# EAGLE design KIK01_LED_Brd (EAGLE 7.2.0)
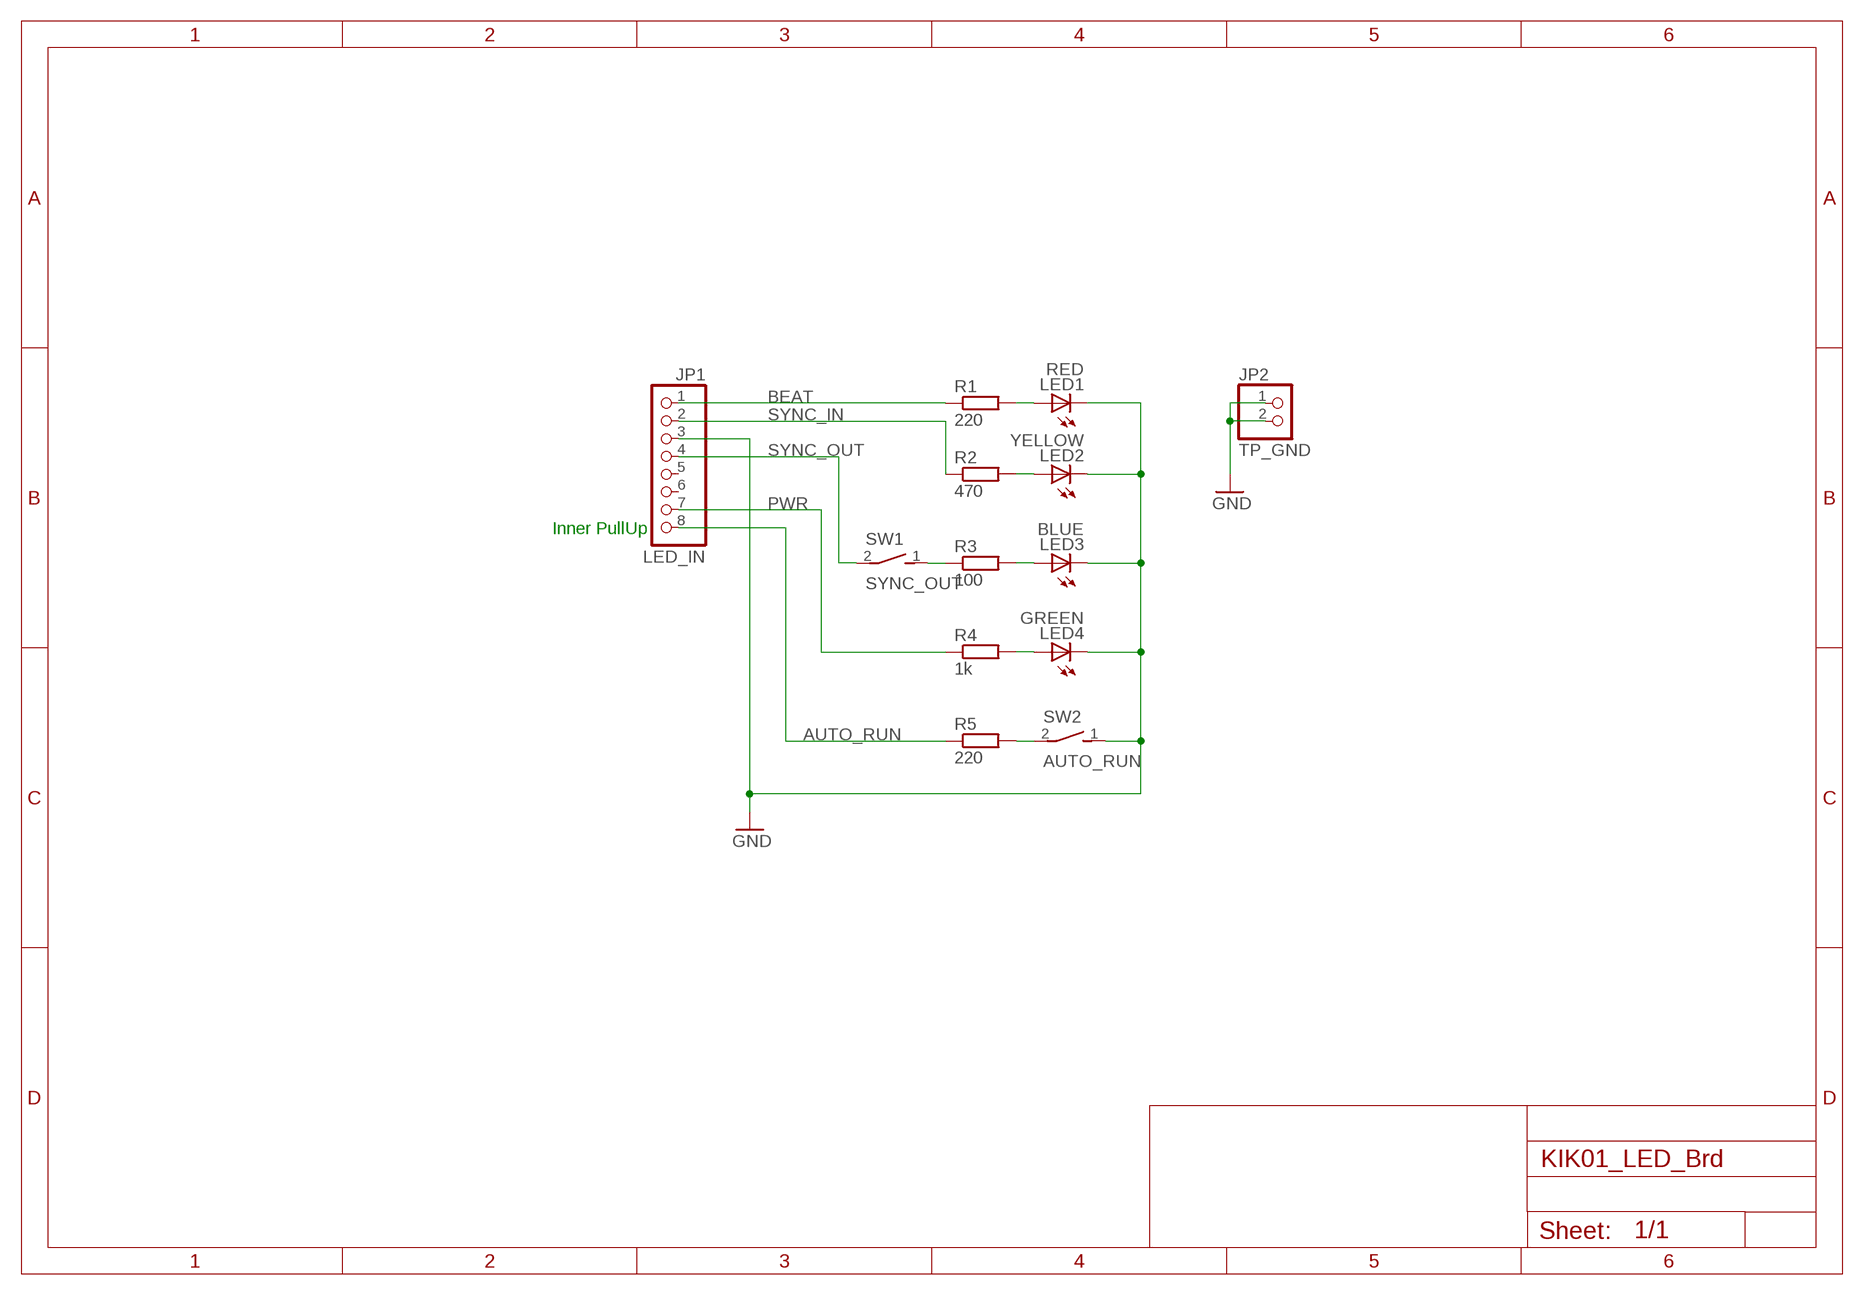
[diagram p0: schematic, sheet 1]

## Parts
JP1  LED_IN  PINHD-1X8  [1X08]
JP2  TP_GND  PINHD-1X2  [1X02]
LED1  RED  LED3MM  [LED3MM]
LED2  YELLOW  LED3MM  [LED3MM]
LED3  BLUE  LED3MM  [LED3MM]
LED4  GREEN  LED3MM  [LED3MM]
R1  220  R-EU_0204/7  [0204/7]
R2  470  R-EU_0204/7  [0204/7]
R3  100  R-EU_0204/7  [0204/7]
R4  1k  R-EU_0204/7  [0204/7]
R5  220  R-EU_0204/7  [0204/7]
SW1  SYNC_OUT  TOGGLE_SW_SPST  [TOGGLE_SW_SPST]
SW2  AUTO_RUN  TOGGLE_SW_SPST  [TOGGLE_SW_SPST]

## Nets
AUTO_RUN: JP1.8 R5.1
BEAT: JP1.1 R1.1
GND: JP1.3 JP2.1 JP2.2 LED1.K(C) LED2.K(C) LED3.K(C) LED4.K(C) SW2.1(S)
N$1: R3.1 SW1.1(S)
N$7: LED1.A R1.2
N$8: LED2.A R2.2
N$9: LED3.A R3.2
N$10: LED4.A R4.2
N$12: R5.2 SW2.2(P)
PWR: JP1.7 R4.1
SYNC_IN: JP1.2 R2.1
SYNC_OUT: JP1.4 SW1.2(P)
Unconnected: JP1.5 JP1.6

## Notes on the sheet
- Inner PullUp

## Library data of the parts
JP1 = pinhead:PINHD-1X8: PIN HEADER
JP2 = pinhead:PINHD-1X2: PIN HEADER
LED1-LED4 = led:LED: LED OSRAM: - CHIPLED LG R971, LG N971, LY N971, LG Q971, LY Q971, LO R971, LY R971 LH N974, LH R974 LS Q976, LO Q976, LY Q976 LO Q996 - Hyper CHIPLED LW Q18S LB Q993, LB Q99A, LB R99A - SideLED LS A670, LO A670, LY A670, LG A670, LP A670 LB A673, LV A673, LT A673, LW A673 LH A674 LY A675 LS A676, LA A676, LO A676, LY A676, LW A676 LS A679, LY A679, LG A679 - Hyper Micro SIDELED® LS Y876, LA Y876, LO Y876, LY Y876 LT Y87S - SmartLED LW L88C, LW L88S LB L89C, LB L89S, LG L890 LS L89K, LO L89K, LY L89K LS L896, LA L896, LO L896, LY L896 - TOPLED LS T670, LO T670, LY T670, LG T670, LP T670 LSG T670, LSP T670, LSY T670, LOP T670, LYG T670 LG T671, LOG T671, LSG T671 LB T673, LV T673, LT T673, LW T673 LH T674 LS T676, LA T676, LO T676, LY T676, LB T676, LH T676, LSB T676, LW T676 LB T67C, LV T67C, LT T67C, LS T67K, LO T67K, LY T67K, LW E67C LS E67B, LA E67B, LO E67B, LY E67B, LB E67C, LV E67C, LT E67C LW T67C LS T679, LY T679, LG T679 LS T770, LO T770, LY T770, LG T770, LP T770 LB T773, LV T773, LT T773, LW T773 LH T774 LS E675, LA E675, LY E675, LS T675 LS T776, LA T776, LO T776, LY T776, LB T776 LHGB T686 LT T68C, LB T68C - Hyper Mini TOPLED® LB M676 - Mini TOPLED Santana® LG M470 LS M47K, LO M47K, LY M47K Source: http://www.osram.convergy.de LUXEON: - LUMILED® LXK2-PW12-R00, LXK2-PW12-S00, LXK2-PW14-U00, LXK2-PW14-V00 LXK2-PM12-R00, LXK2-PM12-S00, LXK2-PM14-U00 LXK2-PE12-Q00, LXK2-PE12-R00, LXK2-PE12-S00, LXK2-PE14-T00, LXK2-PE14-U00 LXK2-PB12-K00, LXK2-PB12-L00, LXK2-PB12-M00, LXK2-PB14-N00, LXK2-PB14-P00, LXK2-PB14-Q00 LXK2-PR12-L00, LXK2-PR12-M00, LXK2-PR14-Q00, LXK2-PR14-R00 LXK2-PD12-Q00, LXK2-PD12-R00, LXK2-PD12-S00 LXK2-PH12-R00, LXK2-PH12-S00 LXK2-PL12-P00, LXK2-PL12-Q00, LXK2-PL12-R00 Source: www.luxeon.com KINGBRIGHT: KA-3528ASYC Source: www.kingbright.com
R1-R5 = rcl:R-EU_: RESISTOR, European symbol
SW1 SW2 = mylib2:TOGGLE_SW_SPST: Toggle switch SPST

## Board
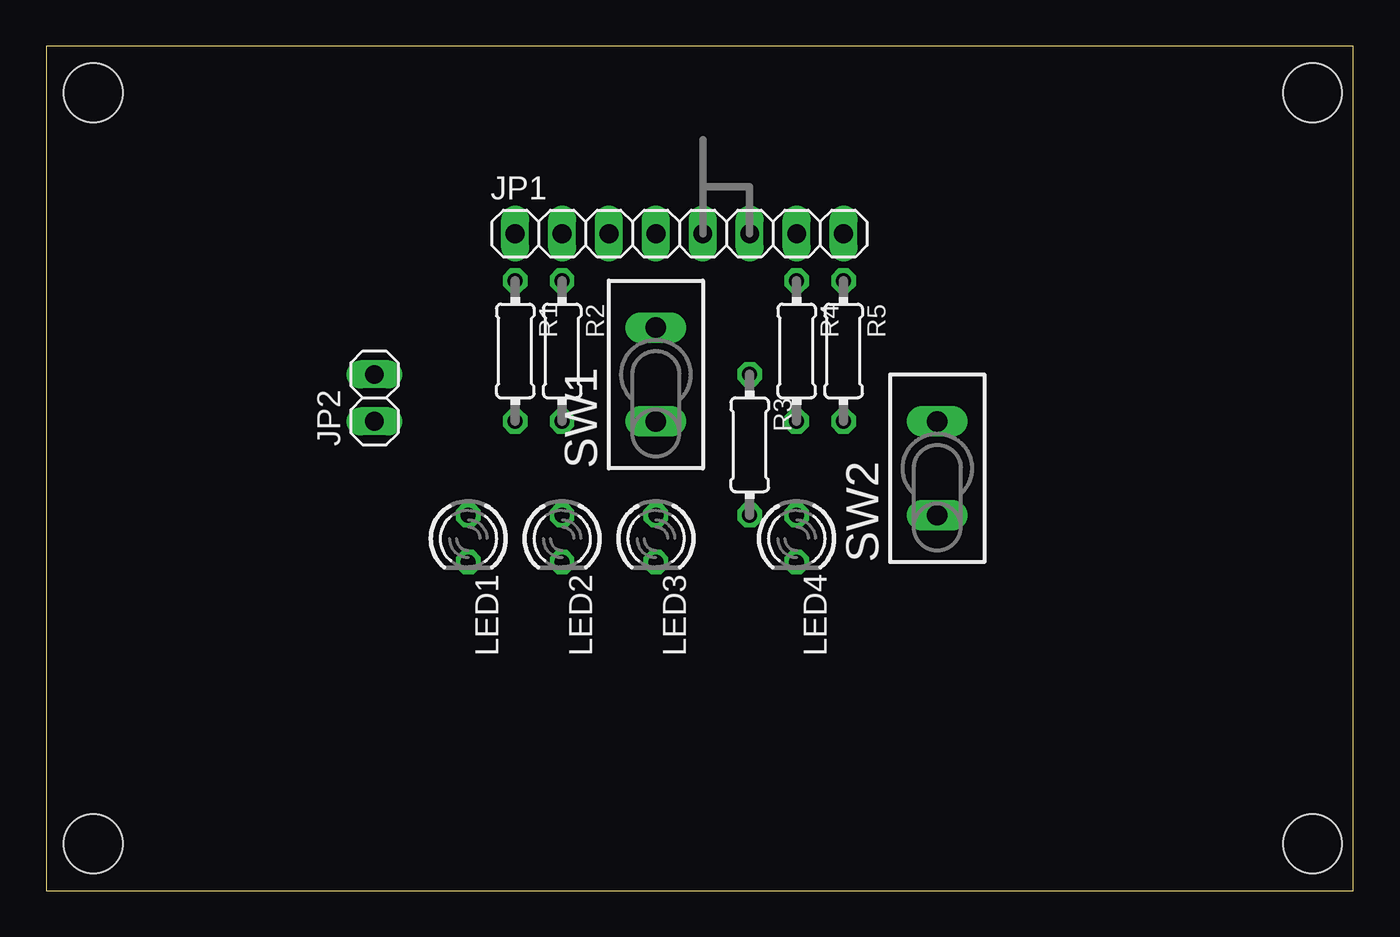
[diagram p1: board, top side]
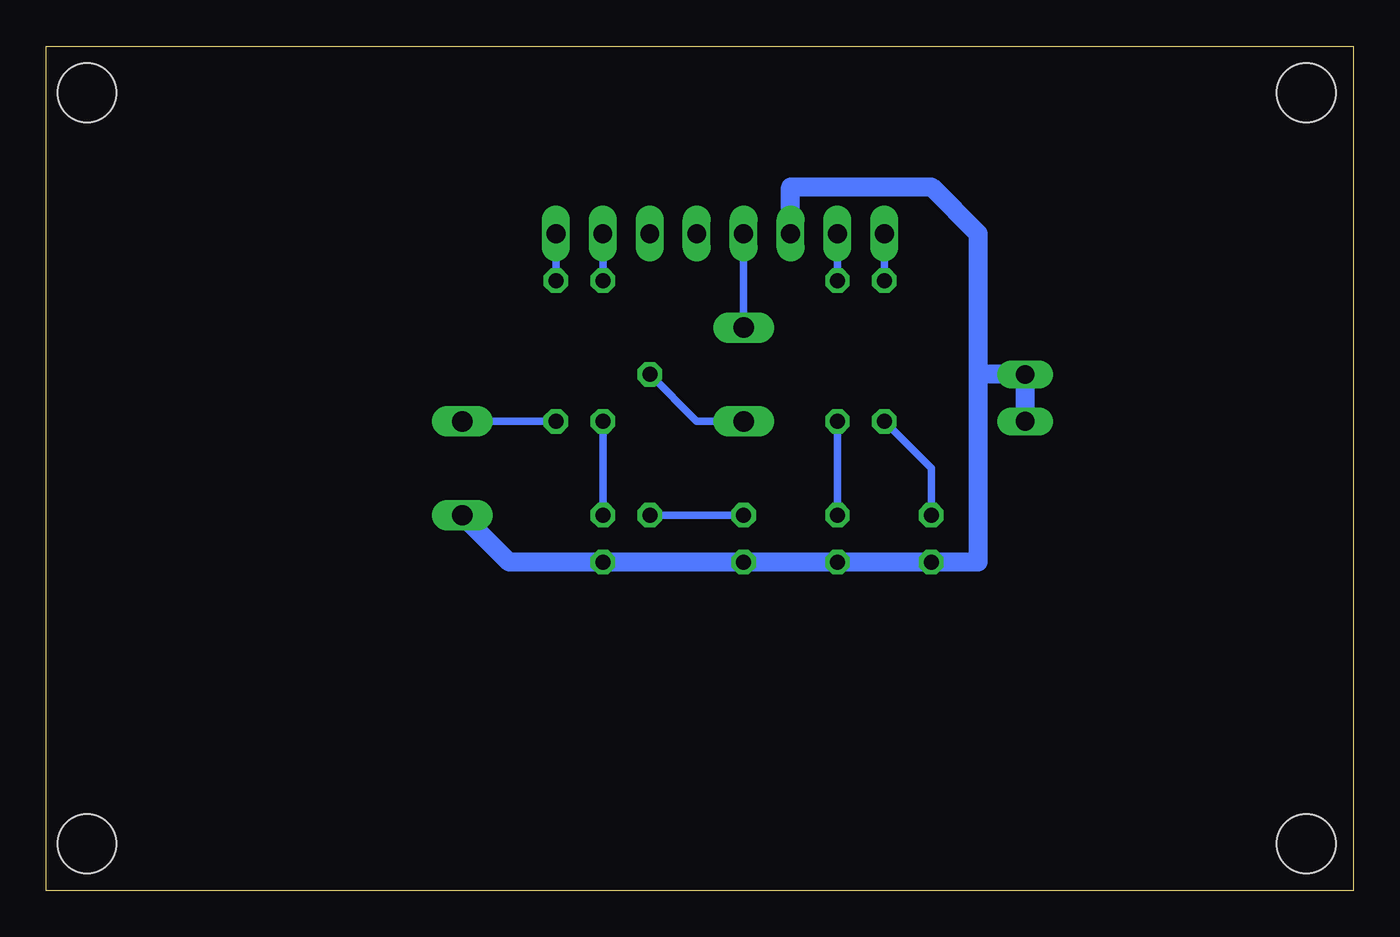
[diagram p2: board, bottom side, seen from below]

Size 70.79 x 45.71 mm. Coordinates in mm from the lower left corner, seen from the top.
Outline: 0,0 70.79,0 70.79,45.71 0,45.71 0,0
Copper layers (1*16): Top 0.035mm / dielectric 1.5mm / Bottom 0.035mm
Design rules "default": minimum track width 10mil, minimum drill 24mil, track to track 8mil, track to pad 8mil, pad to pad 8mil, via to via 8mil, smd to smd 8mil, copper to edge 40mil, drill to drill 8mil, minimum pad ring 10mil, minimum via ring 8mil, stop-mask expansion 4mil, vias tented up to drill 0mil, thermal gap 10mil
Holes 3.2 mm at 2.54,43.18 2.54,2.54 68.58,2.54 68.58,43.18

### Footprints (pad centres in the part's own frame; a part is rotated, then mirrored left to right if it is on the bottom)
1X08 = drill 1.016 long: 1 -8.89,0; 2 -6.35,0; 3 -3.81,0; 4 -1.27,0; 5 1.27,0; 6 3.81,0; 7 6.35,0; 8 8.89,0
1X02 = drill 1.016 long: 1 -1.27,0; 2 1.27,0
LED3MM = drill 0.813 octagon: A -1.27,0; K 1.27,0
0204/7 = drill 0.813 octagon: 1 -3.81,0; 2 3.81,0
TOGGLE_SW_SPST = drill 1.1 pad 1.422 long: 1 -2.54,-1.27; 2 2.54,-1.27

### Placement (x,y rotation side)
JP1  34.29,35.56 0 top
JP2  17.78,26.67 90 top
LED1  22.86,19.05 270 top
LED2  27.94,19.05 270 top
LED3  33.02,19.05 270 top
LED4  40.64,19.05 270 top
R1  25.4,29.21 270 top
R2  27.94,29.21 270 top
R3  38.1,24.13 270 top
R4  40.64,29.21 270 top
R5  43.18,29.21 270 top
SW1  31.75,27.94 90 top
SW2  46.99,22.86 90 top

### Tracks (layer width: path | path; a pad name or v marks a point on that pad's centre or on a via)
AUTO_RUN
  Bottom 0.406: JP1.8 R5.1
BEAT
  Bottom 0.406: JP1.1 R1.1
GND
  Bottom 1.016: 20.32,27.94 20.32,35.56 22.86,38.1 30.48,38.1 JP1.3 | 20.32,27.94 20.32,17.78 LED1.K LED2.K LED3.K LED4.K 45.72,17.78 SW2.1 | 20.32,27.94 JP2.2 JP2.1
N$1
  Bottom 0.406: SW1.1 35.56,25.4 R3.1
N$7
  Bottom 0.406: LED1.A 22.86,22.86 R1.2
N$8
  Bottom 0.406: R2.2 LED2.A
N$9
  Bottom 0.406: LED3.A R3.2
N$10
  Bottom 0.406: R4.2 LED4.A
N$12
  Bottom 0.406: R5.2 SW2.2
PWR
  Bottom 0.406: JP1.7 R4.1
SYNC_IN
  Bottom 0.406: JP1.2 R2.1
SYNC_OUT
  Bottom 0.406: JP1.4 SW1.2

### Text on the board
tDocu: NC